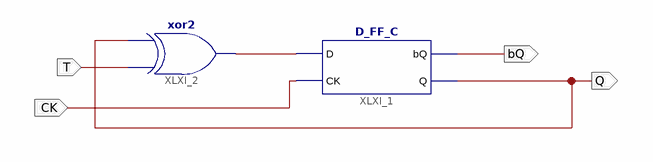
[diagram p0: schematic sheet 1]
// Xilinx ISE schematic T_FF_C2.sch (spartan6) as structural Verilog: 2 symbols, 4 ports
module T_FF_C2 (
  input  T,
  input  CK,
  output Q,
  output bQ
);

  wire XLXN_6;

  D_FF_C XLXI_1 (.D(XLXN_6), .CK(CK), .bQ(bQ), .Q(Q));
  xor XLXI_2 (XLXN_6, T, Q);
endmodule
